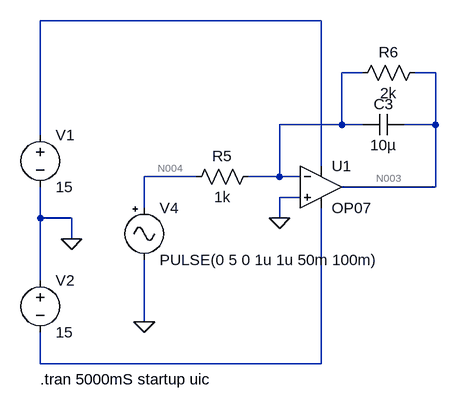
[diagram p0: schematic TriangularConverter.asc]
TriangularConverter.asc, the LTspice schematic file:
Version 4
SHEET 1 1140 680
WIRE 192 -48 -240 -48
WIRE 256 32 224 32
WIRE 368 32 336 32
WIRE 224 112 224 32
WIRE 224 112 128 112
WIRE 256 112 224 112
WIRE 368 112 368 32
WIRE 368 112 320 112
WIRE -240 128 -240 -48
WIRE 192 176 192 -48
WIRE 0 192 -80 192
WIRE 128 192 128 112
WIRE 128 192 80 192
WIRE 160 192 128 192
WIRE 368 208 368 112
WIRE 368 208 224 208
WIRE 160 224 128 224
WIRE -80 240 -80 192
WIRE -240 256 -240 208
WIRE -192 256 -240 256
WIRE 128 256 128 224
WIRE -192 288 -192 256
WIRE -240 352 -240 256
WIRE -80 416 -80 320
WIRE -240 480 -240 432
WIRE 192 480 192 240
WIRE 192 480 -240 480
FLAG -80 416 0
FLAG 128 256 0
FLAG -192 288 0
SYMBOL voltage -240 112 R0
WINDOW 123 0 0 Left 2
WINDOW 39 0 0 Left 2
SYMATTR InstName V1
SYMATTR Value 15
SYMBOL voltage -240 336 R0
WINDOW 123 0 0 Left 2
WINDOW 39 0 0 Left 2
SYMATTR InstName V2
SYMATTR Value 15
SYMBOL res 96 176 R90
WINDOW 0 0 56 VBottom 2
WINDOW 3 32 56 VTop 2
SYMATTR InstName R5
SYMATTR Value 1k
SYMBOL cap 320 96 R90
WINDOW 0 0 32 VBottom 2
WINDOW 3 32 32 VTop 2
SYMATTR InstName C3
SYMATTR Value 10µ
SYMBOL res 352 16 R90
WINDOW 0 0 56 VBottom 2
WINDOW 3 32 56 VTop 2
SYMATTR InstName R6
SYMATTR Value 2k
SYMBOL Opamps\\OP07 192 144 R0
SYMATTR InstName U1
SYMBOL Misc\\signal -80 224 R0
WINDOW 123 0 0 Left 2
WINDOW 39 0 0 Left 2
SYMATTR InstName V4
SYMATTR Value PULSE(0 5 0 1u 1u 50m 100m)
TEXT -240 504 Left 2 !.tran 5000mS startup uic

The netlist it stands for:
* TriangularConverter.asc
V1 N001 0 15
V2 0 N005 15
R5 N002 N004 1k
C3 N003 N002 10µ
R6 N003 N002 2k
XU1 0 N002 N001 N005 N003 LT1001  ; OP07, pins In+ In- V+ V- OUT
V4 N004 0 PULSE(0 5 0 1u 1u 50m 100m)
.tran 5000mS startup uic
.lib LTC.lib
.backanno
.end

* Results of the author's LTspice run, read from the files saved beside the schematic
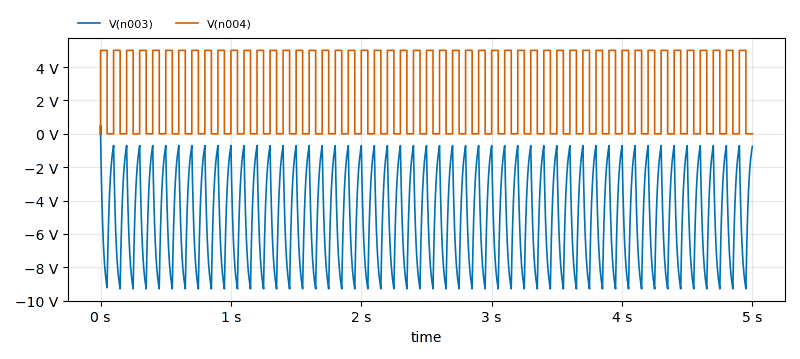
[diagram p1: Transient Analysis of TriangularConverter.asc, plotted from the saved traces]
* Transient Analysis, 1 run:
*   V(n003): min -9.29 V, max 508.9 mV, average -4.997 V, rms 5.754 V, last -751.9 mV
*   V(n004): min 0 V, max 5 V, average 2.5 V, rms 3.536 V, last 0 V